# Altium schematic sheet TopLevel.SchDoc
size A3; SheetNumber: 1; SheetTotal: 5
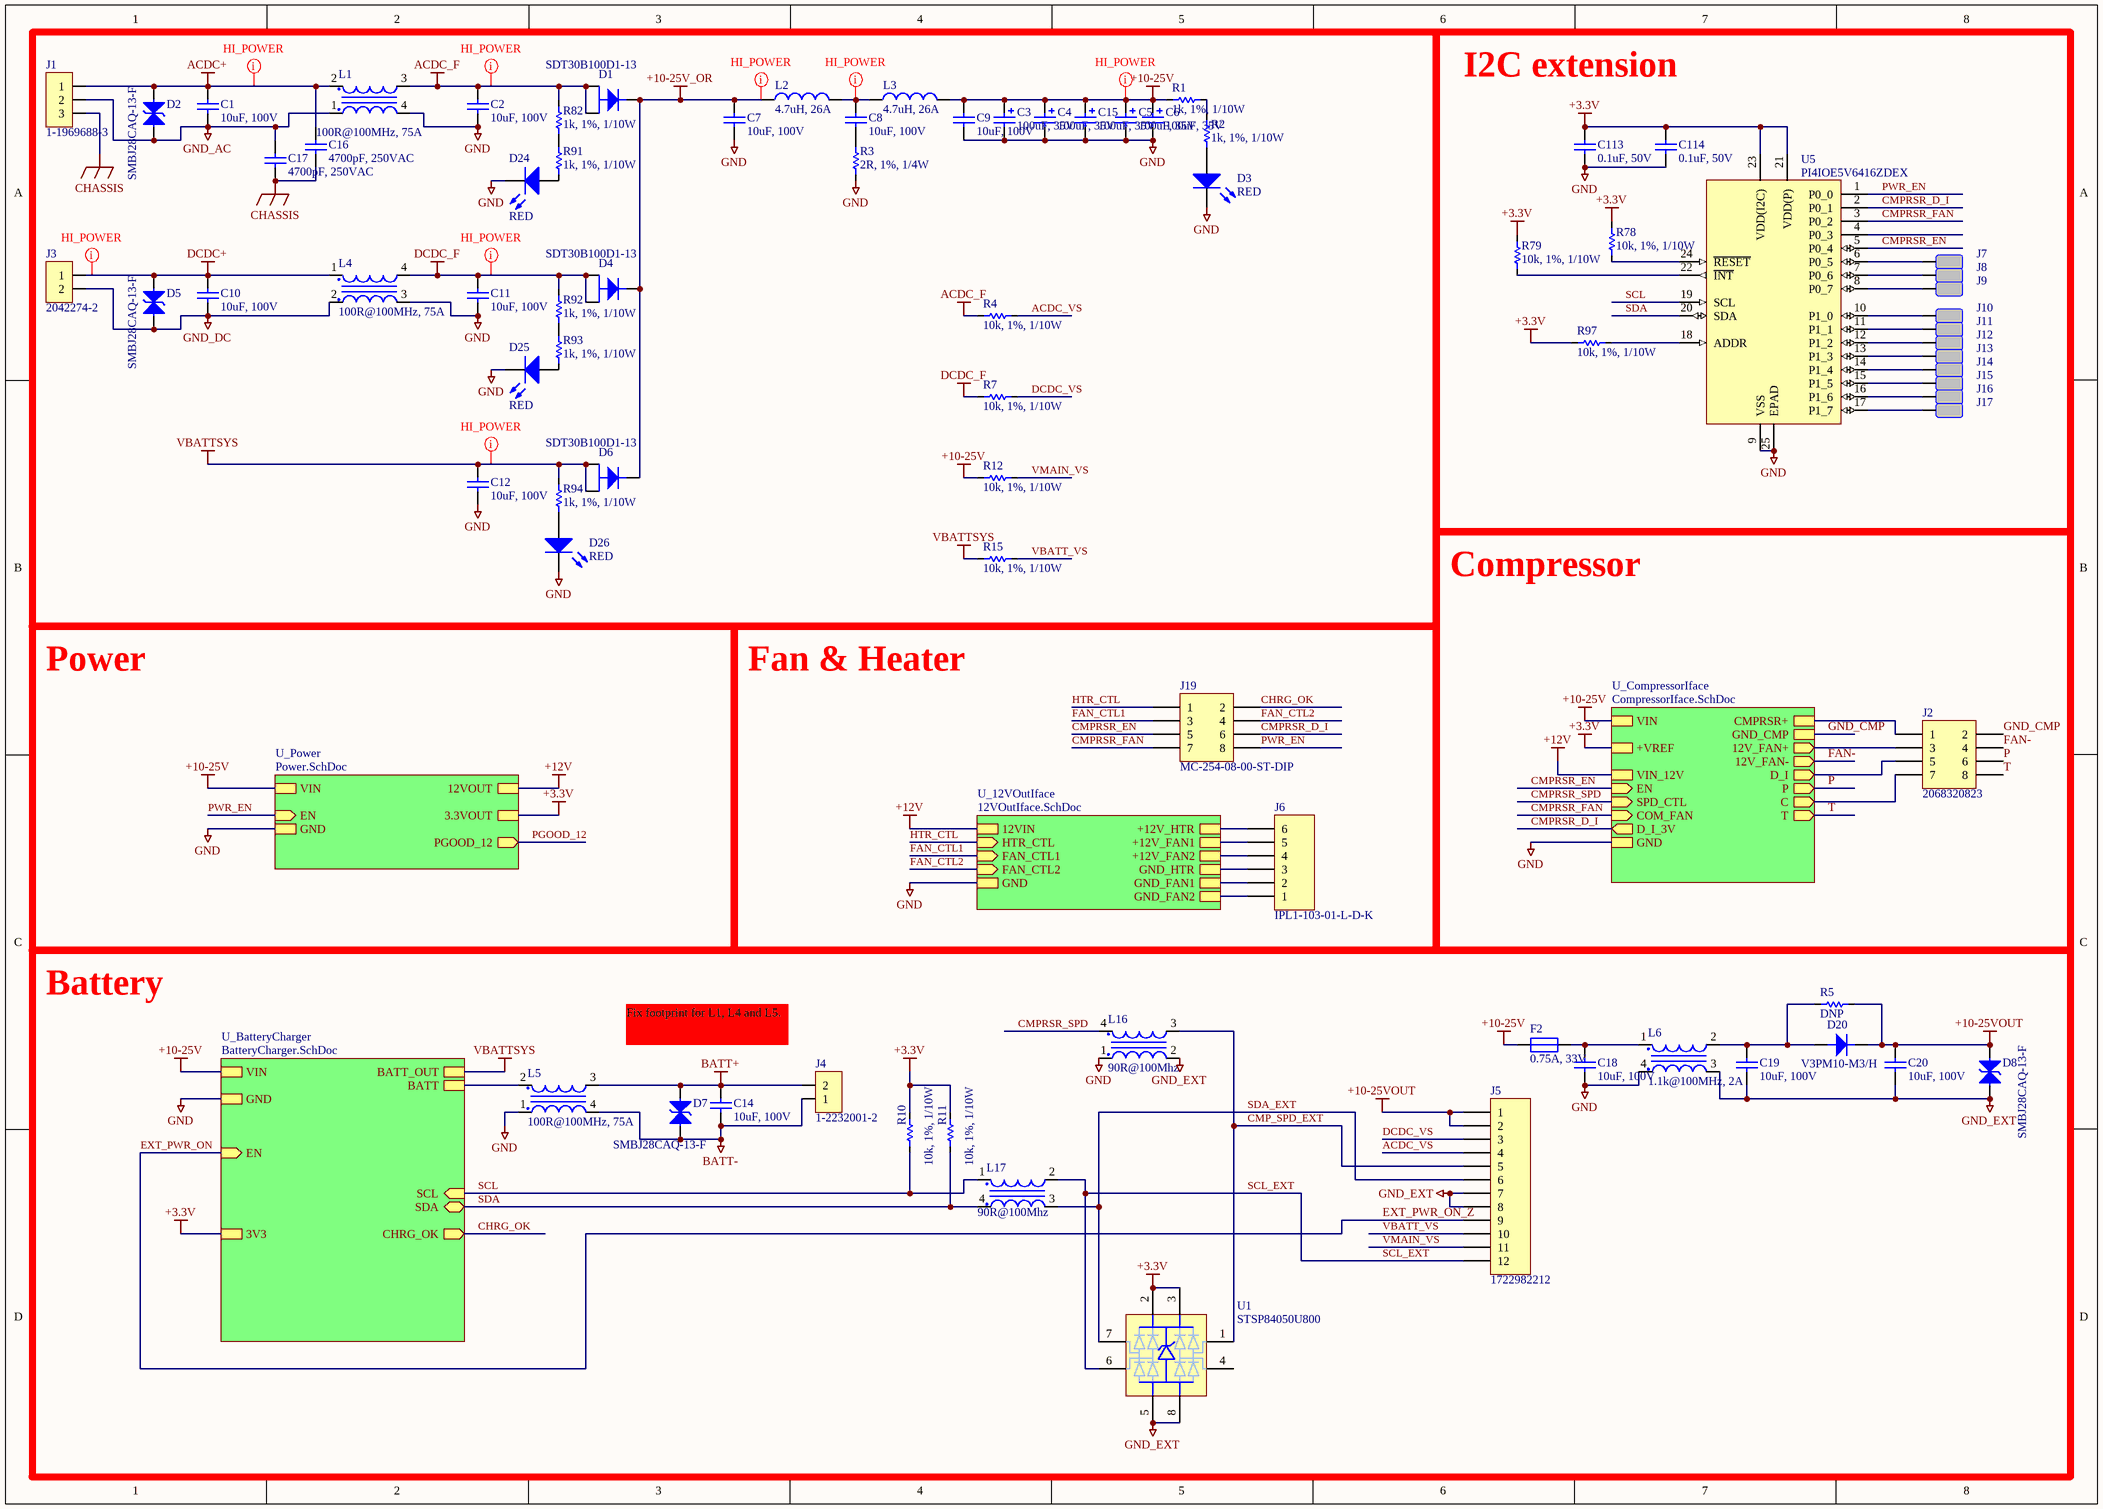
[diagram p0: TopLevel.SchDoc]

## Parts
C1  10uF, 100V  [1210]
C2  10uF, 100V  [1210]
C3  100uF, 35V  [CAPAE7866X80L]
C4  100uF, 35V  [CAPAE7866X80L]
C5  100uF, 35V  [CAPAE7866X80L]
C6  100uF, 35V  [CAPAE7866X80L]
C7  10uF, 100V  [1210]
C8  10uF, 100V  [1210]
C9  10uF, 100V  [1210]
C10  10uF, 100V  [1210]
C11  10uF, 100V  [1210]
C12  10uF, 100V  [1210]
C14  10uF, 100V  [1210]
C15  100uF, 35V  [CAPAE7866X80L]
C16  4700pF, 250VAC  [2220-2.5_CAP]
C17  4700pF, 250VAC  [2220-2.5_CAP]
C18  10uF, 100V  [1210]
C19  10uF, 100V  [1210]
C20  10uF, 100V  [1210]
C113  0.1uF, 50V  [0603]
C114  0.1uF, 50V  [0603]
D1  SDT30B100D1-13  [DPAK]
D2  SMBJ28CAQ-13-F  [SMB]
D3  RED  [0603_DIODE_K1A2]
D4  SDT30B100D1-13  [DPAK]
D5  SMBJ28CAQ-13-F  [SMB]
D6  SDT30B100D1-13  [DPAK]
D7  SMBJ28CAQ-13-F  [SMB]
D8  SMBJ28CAQ-13-F  [SMB]
D20  V3PM10-M3/H  [SMP]
D24  RED  [0603_DIODE_K1A2]
D25  RED  [0603_DIODE_K1A2]
D26  RED  [0603_DIODE_K1A2]
F2  0.75A, 33V  [1812_CAP]
J1  1-1969688-3  [CONN_TE_1-1969688-3]
J2  2068320823  [CONN_206832-0823]
J3  2042274-2  [CONN_TE_2042274-2]
J4  1-2232001-2  [CONN_TE_1-2232001-2]
J5  1722982212  [CONN_MOLEX_1722982212]
J6  IPL1-103-01-L-D-K  [CONN_SAMTEC_IPL1-103-XX-X-D]
J7  1.5x3.5  [PAD_15_35]  (value not drawn)  (no BOM)
J8  1.5x3.5  [PAD_15_35]  (value not drawn)  (no BOM)
J9  1.5x3.5  [PAD_15_35]  (value not drawn)  (no BOM)
J10  1.5x3.5  [PAD_15_35]  (value not drawn)  (no BOM)
J11  1.5x3.5  [PAD_15_35]  (value not drawn)  (no BOM)
J12  1.5x3.5  [PAD_15_35]  (value not drawn)  (no BOM)
J13  1.5x3.5  [PAD_15_35]  (value not drawn)  (no BOM)
J14  1.5x3.5  [PAD_15_35]  (value not drawn)  (no BOM)
J15  1.5x3.5  [PAD_15_35]  (value not drawn)  (no BOM)
J16  1.5x3.5  [PAD_15_35]  (value not drawn)  (no BOM)
J17  1.5x3.5  [PAD_15_35]  (value not drawn)  (no BOM)
J19  MC-254-08-00-ST-DIP  [CONN_206832]
L1  100R@100MHz, 75A  [FIL_CM5441Z101B-10]
L2  4.7uH, 26A  [INDM178169X70N]
L3  4.7uH, 26A  [INDM178169X70N]
L4  100R@100MHz, 75A  [FIL_CM5441Z101B-10]
L5  100R@100MHz, 75A  [FIL_CM5441Z101B-10]
L6  1.1k@100MHz, 2A  [PLCC440P435X370X235-4L]
L16  90R@100Mhz  [BOURNS_SRF2012]
L17  90R@100Mhz  [BOURNS_SRF2012]
R1  1k, 1%, 1/10W  [0603]
R2  1k, 1%, 1/10W  [0603]
R3  2R, 1%, 1/4W  [1206]
R4  10k, 1%, 1/10W  [0603]
R5  DNP  [0805]
R7  10k, 1%, 1/10W  [0603]
R10  10k, 1%, 1/10W  [0603]
R11  10k, 1%, 1/10W  [0603]
R12  10k, 1%, 1/10W  [0603]
R15  10k, 1%, 1/10W  [0603]
R78  10k, 1%, 1/10W  [0603]
R79  10k, 1%, 1/10W  [0603]
R82  1k, 1%, 1/10W  [0603]
R91  1k, 1%, 1/10W  [0603]
R92  1k, 1%, 1/10W  [0603]
R93  1k, 1%, 1/10W  [0603]
R94  1k, 1%, 1/10W  [0603]
R97  10k, 1%, 1/10W  [0603]
U1  STSP84050U800  [SOIC127P600X163-8N]
U5  PI4IOE5V6416ZDEX  [QFN50P400X400X90_HS-25L]

## Blocks framed on the sheet
I2C extension: C113 C114 J7-J17 R78 R79 R97 U5
Compressor: J2
Fan & Heater: J6 J19
Battery: C14 C18-C20 D7 D8 D20 F2 J4 J5 L5 L6 L16 L17 R5 R10 R11 U1

## Sub-sheets
U_12VOutIface = 12VOutIface.SchDoc: 12VIN, GND, HTR_CTL (in), FAN_CTL1 (in), FAN_CTL2 (in), +12V_FAN1, +12V_FAN2, +12V_HTR, GND_HTR, GND_FAN2, GND_FAN1
U_BatteryCharger = BatteryCharger.SchDoc: VIN, GND, EN (in), BATT_OUT, BATT, CHRG_OK (out), SCL (in), SDA (bidir), 3V3
U_CompressorIface = CompressorIface.SchDoc: VIN, EN (in), GND, SPD_CTL (in), D_I_3V (out), COM_FAN (in), +VREF, CMPRSR+, 12V_FAN+ (out), 12V_FAN- (out), D_I (out), C (out), P (out), T (out), GND_CMP, VIN_12V
U_Power = Power.SchDoc: EN (in), VIN, GND, 12VOUT, PGOOD_12 (out), 3.3VOUT

## Nets
+3.3V: C113.1 C114.1 R10.1 R11.1 R78.1 R79.1 R97.1 U1.2 U1.3 U5.21(VDD(P)) U5.23(VDD(I2C)) ; sheet U_BatteryCharger/3V3, sheet U_CompressorIface/+VREF, sheet U_Power/3.3VOUT
+10-25V: C3.1 C4.1 C5.1 C6.1 C9.2 C15.1 F2.2(K) L3.2 R1.2 R12.2 ; sheet U_BatteryCharger/VIN, sheet U_CompressorIface/VIN, sheet U_Power/VIN
+10-25V_OR: C7.2 D1.2(K) D4.2(K) D6.2(K) L2.1
+10-25VOUT: C20.2 D8.2(K) D20.2(K) J5.1 J5.2 R5.2
+12V: sheet U_CompressorIface/VIN_12V, sheet U_Power/12VOUT, sheet U_12VOutIface/12VIN
ACDC+: C1.2 C16.2 D2.2(K) J1.1 L1.2
ACDC_F: C2.2 D1.1(A) D1.3(A) L1.3 R4.2 R82.1
BATT+: C14.2 D7.2(K) J4.2 L5.3
BATT-: C14.1 D7.1(A) J4.1 L5.4
CHASSIS: C16.1 C17.1 J1.3
DCDC+: C10.2 D5.2(K) J3.1 L4.1
DCDC_F: C11.2 D4.1(A) D4.3(A) L4.4 R7.2 R92.1
GND: C2.1 C3.2 C4.2 C5.2 C6.2 C7.1 C9.1 C11.1 C12.1 C15.2 C18.1 C113.2 C114.2 D3.2(K) D24.2(K) D25.2(K) D26.2(K) L1.4 L4.3 L5.1 L6.4 L16.1 R3.1 U5.9(VSS) U5.25(EPAD) ; sheet U_BatteryCharger/GND, sheet U_CompressorIface/GND, sheet U_Power/GND, sheet U_12VOutIface/GND
GND_AC: C1.1 C17.2 D2.1(A) J1.2 L1.1
GND_DC: C10.1 D5.1(A) J3.2 L4.2
GND_EXT: C19.1 C20.1 D8.1(A) J5.7 J5.8 L6.3 L16.2 U1.5 U1.8
VBATTSYS: C12.2 D6.1(A) D6.3(A) R15.2 R94.1 ; sheet U_BatteryCharger/BATT_OUT
ACDC_VS: J5.4 R4.1
CHRG_OK: J19.2 ; sheet U_BatteryCharger/CHRG_OK
CMP_SPD_EXT: J5.5 L16.3 U1.1
CMPRSR_D_I: J19.6 U5.2(P0_1) ; sheet U_CompressorIface/D_I_3V
CMPRSR_EN: J19.5 U5.5(P0_4) ; sheet U_CompressorIface/EN
CMPRSR_FAN: J19.7 U5.3(P0_2) ; sheet U_CompressorIface/COM_FAN
CMPRSR_SPD: L16.4 ; sheet U_CompressorIface/SPD_CTL
DCDC_VS: J5.3 R7.1
EXT_PWR_ON: J5.9 ; sheet U_BatteryCharger/EN  [also labelled EXT_PWR_ON_Z]
FAN-: J2.4 ; sheet U_CompressorIface/12V_FAN-
FAN_CTL1: J19.3 ; sheet U_12VOutIface/FAN_CTL1
FAN_CTL2: J19.4 ; sheet U_12VOutIface/FAN_CTL2
GND_CMP: J2.2 ; sheet U_CompressorIface/GND_CMP
HTR_CTL: J19.1 ; sheet U_12VOutIface/HTR_CTL
P: J2.6 ; sheet U_CompressorIface/P
PGOOD_12: sheet U_Power/PGOOD_12
PWR_EN: J19.8 U5.1(P0_0) ; sheet U_Power/EN
SCL: L17.1 R10.2 U5.19(SCL) ; sheet U_BatteryCharger/SCL
SCL_EXT: J5.12 L17.2 U1.6
SDA: L17.4 R11.2 U5.20(SDA) ; sheet U_BatteryCharger/SDA
SDA_EXT: J5.6 L17.3 U1.7
T: J2.8 ; sheet U_CompressorIface/T
VBATT_VS: J5.10 R15.1
VMAIN_VS: J5.11 R12.1
NetC8_1: C8.1 R3.2
NetC8_2: C8.2 L2.2 L3.1
NetC18_2: C18.2 F2.1(A) L6.1
NetC19_2: C19.2 D20.1(A) L6.2 R5.1
NetD3_1: D3.1(A) R2.2
NetD24_1: D24.1(A) R91.2
NetD25_1: D25.1(A) R93.2
NetD26_1: D26.1(A) R94.2
NetJ2_1: J2.1 ; sheet U_CompressorIface/CMPRSR+
NetJ2_3: J2.3 ; sheet U_CompressorIface/12V_FAN+
NetJ2_5: J2.5 ; sheet U_CompressorIface/D_I
NetJ2_7: J2.7 ; sheet U_CompressorIface/C
NetJ6_1: J6.1 ; sheet U_12VOutIface/GND_FAN2
NetJ6_2: J6.2 ; sheet U_12VOutIface/GND_FAN1
NetJ6_3: J6.3 ; sheet U_12VOutIface/GND_HTR
NetJ6_4: J6.4 ; sheet U_12VOutIface/+12V_FAN2
NetJ6_5: J6.5 ; sheet U_12VOutIface/+12V_FAN1
NetJ6_6: J6.6 ; sheet U_12VOutIface/+12V_HTR
NetJ7_1: J7.1 U5.6(P0_5)
NetJ8_1: J8.1 U5.7(P0_6)
NetJ9_1: J9.1 U5.8(P0_7)
NetJ10_1: J10.1 U5.10(P1_0)
NetJ11_1: J11.1 U5.11(P1_1)
NetJ12_1: J12.1 U5.12(P1_2)
NetJ13_1: J13.1 U5.13(P1_3)
NetJ14_1: J14.1 U5.14(P1_4)
NetJ15_1: J15.1 U5.15(P1_5)
NetJ16_1: J16.1 U5.16(P1_6)
NetJ17_1: J17.1 U5.17(P1_7)
NetL5_2: L5.2 ; sheet U_BatteryCharger/BATT
NetR1_1: R1.1 R2.1
NetR78_2: R78.2 U5.24(~{RESET})
NetR79_2: R79.2 U5.22(~{INT})
NetR82_2: R82.2 R91.1
NetR92_2: R92.2 R93.1
NetR97_2: R97.2 U5.18(ADDR)

Not connected (* = marked no-connect by the designer): U1 4; U5 4(P0_3)

## Layout directives
net class HI_POWER: +10-25V, +10-25V_OR, ACDC+, ACDC_F, DCDC+, DCDC_F, NetC8_2, VBATTSYS

## Notes on the sheet
- Power
- Fix footprint for L1, L4 and L5.

## Library data of the parts
C1 C2 C7-C12 C14 C18-C20 = NS00779: MLCC 10UF 100V X7S 1210; Type: C; Alternatives: Generic; Part Number: NS00779; Value: 10uF, 100V; Supplier 1: Digi-Key; Supplier Part Number 1: 1276-CL32Y106KCVZNWECT-ND
C3-C6 C15 = NS00911: CAP ALUM 100UF 20% 35V SMD; Type: C; Alternatives: Generic; Part Number: NS00911; Value: 100uF, 35V; Supplier 1: Digi-Key; Supplier Part Number 1: PCE5051CT-ND
C16 C17 = NS00768: CAP CER 4700PF 250VAC X7R 2220; Type: C; Alternatives: Generic; Part Number: NS00768; Value: 4700pF, 250VAC; Supplier 1: Digi-Key; Supplier Part Number 1: 2873-SCC2220X472K502TGCT-ND
C113 C114 = NS00838: CAP CER 0.1UF 50V X7R 0603; Type: C; Alternatives: Generic; Part Number: NS00838; Value: 0.1uF, 50V; Supplier 1: Digi-Key; Supplier Part Number 1: 1276-1935-1-ND
D1 D4 D6 = NS00785: DIODE SCHOTTKY 100V 30A TO252; Part Number: NS00785; Type: Diode; Value: SDT30B100D1-13; ComponentLink1Description: Datasheet; ComponentLink1URL: H:\Doc\Diodes\SDT30B100D1.pdf; Supplier 1: Digi-Key; Supplier Part Number 1: SDT30B100D1-13DICT-ND
D2 D5 D7 D8 = NS00890: TVS DIODE 28VWM 45.4VC SMB; Part Number: NS00890; Type: Diode; Value: SMBJ28CAQ-13-F; ComponentLink1Description: Datasheet; ComponentLink1URL: H:\Doc\Diodes\SMBJ6.5CAQ-SMBJ100CAQ.pdf; Supplier 1: Digi-Key; Supplier Part Number 1: SMBJ28CAQ-13-FDICT-ND
D3 D24-D26 = NS00945: LED RED CLEAR 1608 SMD; Type: IC; Part Number: NS00945; Value: RED; ComponentLink1Description: Datasheet; ComponentLink1URL: H:\Doc\Harvatek\B1911USD-20D000114U1930.pdf; Supplier 1: Digi-Key; Supplier Part Number 1: 3147-B1911USD-20D000114U1930CT-ND
D20 = NS00857: SCHOTTKY RECTIFIER 3A 100V SMP; Part Number: NS00857; Type: Diode; Value: V3PM10-M3/H; ComponentLink1Description: Datasheet; ComponentLink1URL: H:\Doc\Vishay\v3pm10.pdf; Supplier 1: Digi-Key; Supplier Part Number 1: 112-V3PM10-M3/HCT-ND
F2 = NS00949: PTC RESET FUSE 33V 750MA 1812; Alternatives: Generic; Part Number: NS00949; Type: Fuse; Value: 0.75A, 33V; Supplier 1: Digi-Key; Supplier Part Number 1: 283-3153-1-ND
J1 = NS00900: CONN HEADER VERT 3POS 6MM; Part Number: NS00900; Type: Connector; Value: 1-1969688-3; ComponentLink1Description: Product Spec; ComponentLink1URL: H:\Doc\Tyco\ENG_SS_108-32090_E.pdf; ComponentLink2Description: Application Spec; ComponentLink2URL: H:\Doc\Tyco\ENG_SS_114-32136_D.pdf; ComponentLink3Description: Drawing; ComponentLink3URL: H:\Doc\Tyco\ENG_CD_1969688_C.pdf; Supplier 1: Digi-Key; Supplier Part Number 1: A120938-ND
J2 = Header 4X2: Connector Header Through Hole 8 position 0.118" (3.00mm); LatestRevisionDate: 17-Jul-2002; LatestRevisionNote: Re-released for DXP Platform.; Publisher: Altium Limited; Supplier 1: Digi-Key; Supplier Part Number 1: WM10684-ND
J3 = NS00791: CONN HEADER 2POS PCB; Part Number: NS00791; Type: Connector; Value: 2042274-2; ComponentLink1Description: Datasheet; ComponentLink1URL: H:\Doc\Tyco\ENG_SS_108-19346_H1.pdf; ComponentLink2Description: Drawing; ComponentLink2URL: H:\Doc\Tyco\ENG_CD_2042274_D.pdf; ComponentLink3Description: Application Specification; ComponentLink3URL: H:\Doc\Tyco\ENG_SS_114-19110_C.pdf; Supplier 1: Digi-Key; Supplier Part Number 1: A105511CT-ND
J4 = NS00788: CONN HEADER VERT 2POS 5MM; Part Number: NS00788; Type: Connector; Value: 1-2232001-2; ComponentLink1Description: Datasheet; ComponentLink1URL: H:\Doc\Tyco\ENG_CD_1971845_B1.pdf; Supplier 1: Digi-Key; Supplier Part Number 1: A117216-ND
J5 = NS00894: CONN HEADER VERT 12POS 3.5MM; Part Number: NS00894; Type: Connector; Value: 1722982212; ComponentLink1Description: Datasheet; ComponentLink1URL: H:\Doc\Molex\1722982212_PCB_HEADERS.pdf; ComponentLink2Description: Application Specification; ComponentLink2URL: H:\Doc\Molex\AS-172323-0001-001.pdf; ComponentLink3Description: Drawing; ComponentLink3URL: H:\Doc\Molex\1722982212_sd.pdf; Supplier 1: Digi-Key; Supplier Part Number 1: WM11767-ND
J6 = NS00897: CONN HEADER VERT 6POS 2.54MM; Part Number: NS00897; Type: Connector; Value: IPL1-103-01-L-D-K; ComponentLink1Description: Datasheet; ComponentLink1URL: H:\Doc\Samtec\100_mini_mate.pdf; ComponentLink2Description: Dimensions; ComponentLink2URL: H:\Doc\Samtec\ipl1.pdf; Supplier 1: Digi-Key; Supplier Part Number 1: SAM9594-ND
J7-J17 = NS00465: PAD SOLDER 1.5x3.5MM; Part Number: NS00465; Type: Mechanical; Value: 1.5x3.5
J19 = Header 4X2: Header, 4-Pin, Dual row; LatestRevisionDate: 17-Jul-2002; LatestRevisionNote: Re-released for DXP Platform.; Publisher: Altium Limited; Supplier 1: Farnell; Supplier Part Number 1: MC-254-08-00-ST-DIP
L1 L4 L5 = NS00942: CMC 75A 2LN 100 OHM TH; Type: Inductor; Part Number: NS00942; Value: 100R@100MHz, 75A; ComponentLink1Description: Datasheet; ComponentLink1URL: H:\Doc\Laird\cm5441z101b-10-datasheet.pdf; Supplier 1: Digi-Key; Supplier Part Number 1: 240-2489-ND
L2 L3 = NS00854: FIXED IND 4.7UH 26A 5.5 MOHM SMD; Part Number: NS00854; Type: Inductor; Value: 4.7uH, 26A; ComponentLink1Description: Datasheet; ComponentLink1URL: H:\Doc\Bourns\srp1770c.pdf; Supplier 1: Digi-Key; Supplier Part Number 1: SRP1770C-4R7MCT-ND
L6 = CHOKE_COMMON_ALT: CMC 2A 2LN 1.1K OHM SMD; Part Number: NS00952; Type: Inductor; Value: 1.1k@100MHz, 2A; ComponentLink1Description: Datasheet; ComponentLink1URL: H:\Doc\Murata\EFLC0026.pdf; Supplier 1: Digi-Key; Supplier Part Number 1: 490-12641-1-ND
L16 L17 = NS00042: INDUCTOR COMMON MODE 90 OHM 25%; Part Number: NS00042; Type: Inductor; Value: 90R@100Mhz; ComponentLink1Description: Datasheet; ComponentLink1URL: H:\Doc\Bourns\SRF2012A.pdf; Supplier 1: Digi-Key; Supplier Part Number 1: SRF2012-900YATR-ND
R1 R2 R82 R91-R94 = NS00882: RES 1K OHM 1% 1/10W 0603; Alternatives: Generic; Part Number: NS00882; Type: R; Value: 1k, 1%, 1/10W; Supplier 1: Digi-Key; Supplier Part Number 1: RMCF0603FT1K00CT-ND
R3 = NS00946: RES 2 OHM 1% 1/4W 1206; Alternatives: Generic; Part Number: NS00946; Type: R; Value: 2R, 1%, 1/4W; Supplier 1: Digi-Key; Supplier Part Number 1: 738-RMCF1206FT2R00CT-ND
R4 R7 R10-R12 R15 R78 R79 R97 = NS00820: RES 10K OHM 1% 1/10W 0603; Alternatives: Generic; Part Number: NS00820; Type: R; Value: 10k, 1%, 1/10W; Supplier 1: Digi-Key; Supplier Part Number 1: RMCF0603FT10K0CT-ND
R5 = NS00258: RES SMD 0.0 OHM JUMPER 1/2W 0805; Value: 0R; Part Number: NS00258; Type: R; Supplier 1: Digi-Key; Supplier Part Number 1: 36-5106CT-ND
U1 = NS00913: TVS DIODE 5VWM 20VC 8-SOP; Part Number: NS00913; Type: IC; Value: STSP84050U800; ComponentLink1Description: Datasheet; ComponentLink1URL: H:\Doc\Eaton\eaton-stsp84xxxxxx-tvs-diode-array-esd-suppressor-data-sheet.pdf; Supplier 1: Digi-Key; Supplier Part Number 1: 283-STSP84050U800CT-ND
U5 = NS00947: IC XPNDR 400KHZ I2C 24TQFN; Part Number: NS00947; Type: IC; Value: PI4IOE5V6416ZDEX; ComponentLink1Description: Datasheet; ComponentLink1URL: H:\Doc\Diodes\PI4IOE5V6416.pdf; Supplier 1: Digi-Key; Supplier Part Number 1: PI4IOE5V6416ZDEXDICT-ND